# Altium schematic sheet RF_Ticketing_Slave.SchDoc
size A4; Author: Mario Dos Santos; Organization: ETML-ES; Address1: Avenue Recordon 1; Address2: 1004 Lausanne; Address3: Switzerland; SheetNumber: 5; SheetTotal: 5
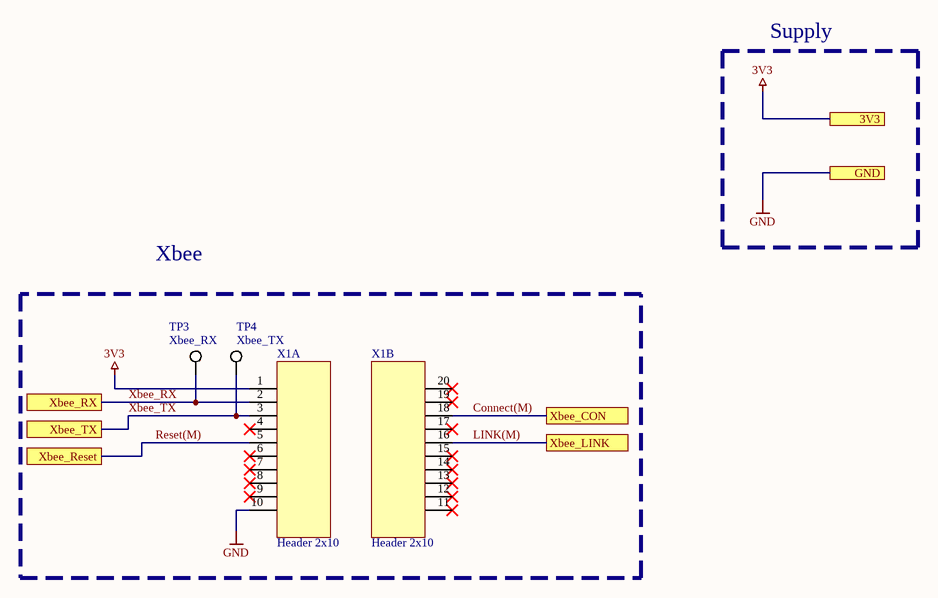
[diagram p0: RF_Ticketing_Slave.SchDoc]

## Parts
TP3  value Xbee_RX  [KSTN-5019_V]
TP4  value Xbee_TX  [KSTN-5019_V]
X1  Header 2x10  [ZB-SB]  (parts A,B of 2)

## Ports
3V3, GND, Xbee_CON, Xbee_LINK, Xbee_Reset, Xbee_RX, Xbee_TX

## Nets
3V3: X1.1 ; port 3V3
GND: X1.10 ; port GND
Connect(M): X1.18 ; port Xbee_CON
LINK(M): X1.16 ; port Xbee_LINK
Reset(M): X1.5 ; port Xbee_Reset
Xbee_RX: TP3.1 X1.2 ; port Xbee_RX
Xbee_TX: TP4.1 X1.3 ; port Xbee_TX

Not connected (* = marked no-connect by the designer): X1 4* 6* 7* 8* 9* 11* 12* 13* 14* 15* 17* 19* 20*

## Notes on the sheet
- Supply
- Xbee
- Fichier :
- a
- Date :
- Heure :
- Version :
- Auteur :
- Modif.
- b
- c
- d
- Projet :
- No :
- Nb feuilles
- Feuille n°
- Chemin :

## Library data of the parts
TP3 TP4 = CMP-1672-00008-1: Test Point, 1 Position SMD, RoHS, Tape and Reel; Supplier: Digi-Key; Supplier Part Number: 36-5019CT-ND; Supplier unit price: 0.33
X1 = HDR ZB-SB 2x10_1: Header 2x10 / Xbee de letml(1623) ou xbee XB24CAUIT-001; Value: Header 2x10; Supplier: Digi-Key